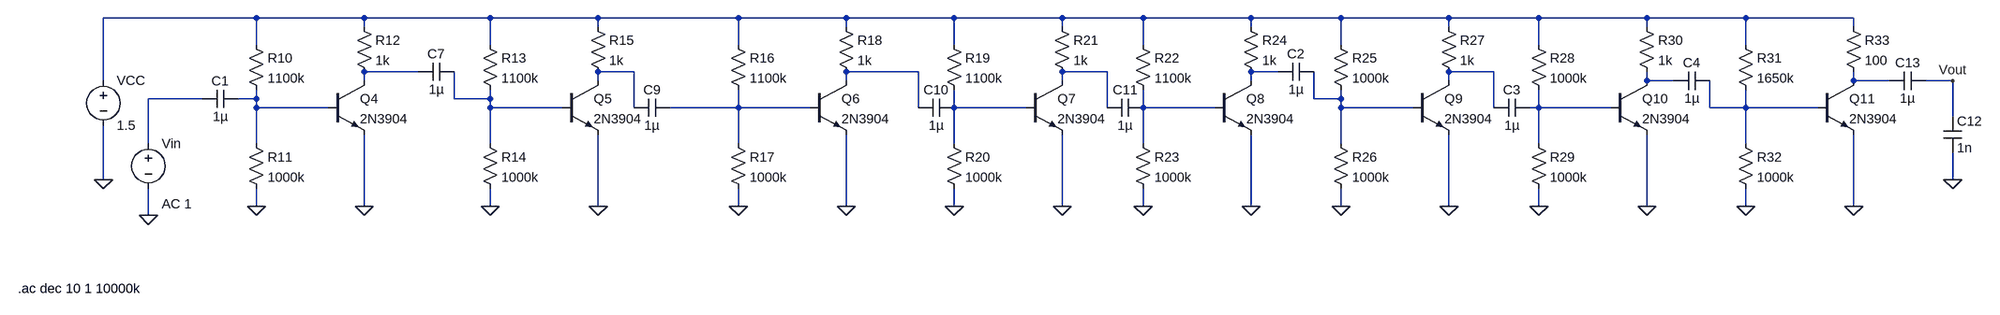
[diagram p0: schematic Bjt_Amp_LTspice.asc]
Bjt_Amp_LTspice.asc, the LTspice schematic file:
Version 4
SHEET 1 2344 728
WIRE -800 -400 -1072 -400
WIRE -608 -400 -800 -400
WIRE -384 -400 -608 -400
WIRE -192 -400 -384 -400
WIRE 64 -400 -192 -400
WIRE 256 -400 64 -400
WIRE 448 -400 256 -400
WIRE 640 -400 448 -400
WIRE 784 -400 640 -400
WIRE 976 -400 784 -400
WIRE 1136 -400 976 -400
WIRE 1328 -400 1136 -400
WIRE 1488 -400 1328 -400
WIRE 1680 -400 1488 -400
WIRE 1856 -400 1680 -400
WIRE 2048 -400 1856 -400
WIRE -608 -384 -608 -400
WIRE -192 -384 -192 -400
WIRE 256 -384 256 -400
WIRE 640 -384 640 -400
WIRE 976 -384 976 -400
WIRE 1328 -384 1328 -400
WIRE 1680 -384 1680 -400
WIRE 2048 -384 2048 -400
WIRE -800 -352 -800 -400
WIRE -384 -352 -384 -400
WIRE 64 -352 64 -400
WIRE 448 -352 448 -400
WIRE 784 -352 784 -400
WIRE 1136 -352 1136 -400
WIRE 1488 -352 1488 -400
WIRE 1856 -352 1856 -400
WIRE -512 -304 -608 -304
WIRE -128 -304 -192 -304
WIRE 384 -304 256 -304
WIRE 720 -304 640 -304
WIRE 1024 -304 976 -304
WIRE 1408 -304 1328 -304
WIRE -1072 -288 -1072 -400
WIRE -608 -288 -608 -304
WIRE -192 -288 -192 -304
WIRE 256 -288 256 -304
WIRE 640 -288 640 -304
WIRE 976 -288 976 -304
WIRE 1328 -288 1328 -304
WIRE 1680 -288 1680 -304
WIRE 1728 -288 1680 -288
WIRE 2048 -288 2048 -304
WIRE 2112 -288 2048 -288
WIRE 2224 -288 2176 -288
WIRE -896 -256 -992 -256
WIRE -800 -256 -800 -272
WIRE -800 -256 -832 -256
WIRE -448 -256 -448 -304
WIRE -384 -256 -384 -272
WIRE -384 -256 -448 -256
WIRE 1088 -256 1088 -304
WIRE 1136 -256 1136 -272
WIRE 1136 -256 1088 -256
WIRE -800 -240 -800 -256
WIRE -672 -240 -800 -240
WIRE -384 -240 -384 -256
WIRE -256 -240 -384 -240
WIRE -128 -240 -128 -304
WIRE 64 -240 64 -272
WIRE 64 -240 -64 -240
WIRE 192 -240 64 -240
WIRE 384 -240 384 -304
WIRE 448 -240 448 -272
WIRE 576 -240 448 -240
WIRE 720 -240 720 -304
WIRE 784 -240 784 -272
WIRE 912 -240 784 -240
WIRE 1136 -240 1136 -256
WIRE 1264 -240 1136 -240
WIRE 1408 -240 1408 -304
WIRE 1488 -240 1488 -272
WIRE 1488 -240 1472 -240
WIRE 1616 -240 1488 -240
WIRE 1792 -240 1792 -288
WIRE 1856 -240 1856 -272
WIRE 1856 -240 1792 -240
WIRE 1984 -240 1856 -240
WIRE 2224 -224 2224 -288
WIRE -992 -176 -992 -256
WIRE -800 -176 -800 -240
WIRE -384 -176 -384 -240
WIRE 64 -176 64 -240
WIRE 448 -176 448 -240
WIRE 784 -176 784 -240
WIRE 1136 -176 1136 -240
WIRE 1488 -176 1488 -240
WIRE 1856 -176 1856 -240
WIRE -1072 -112 -1072 -208
WIRE 2224 -112 2224 -160
WIRE -800 -64 -800 -96
WIRE -608 -64 -608 -192
WIRE -384 -64 -384 -96
WIRE -192 -64 -192 -192
WIRE 64 -64 64 -96
WIRE 256 -64 256 -192
WIRE 448 -64 448 -96
WIRE 640 -64 640 -192
WIRE 784 -64 784 -96
WIRE 976 -64 976 -192
WIRE 1136 -64 1136 -96
WIRE 1328 -64 1328 -192
WIRE 1488 -64 1488 -96
WIRE 1680 -64 1680 -192
WIRE 1856 -64 1856 -96
WIRE 2048 -64 2048 -192
WIRE -992 -48 -992 -96
FLAG -1072 -112 0
FLAG -992 -48 0
FLAG -800 -64 0
FLAG -608 -64 0
FLAG -384 -64 0
FLAG -192 -64 0
FLAG 64 -64 0
FLAG 256 -64 0
FLAG 448 -64 0
FLAG 640 -64 0
FLAG 784 -64 0
FLAG 976 -64 0
FLAG 1136 -64 0
FLAG 1328 -64 0
FLAG 1488 -64 0
FLAG 1680 -64 0
FLAG 1856 -64 0
FLAG 2048 -64 0
FLAG 2224 -112 0
FLAG 2224 -288 Vout
SYMBOL voltage -1072 -304 R0
SYMATTR InstName VCC
SYMATTR Value 1.5
SYMBOL voltage -992 -192 R0
WINDOW 123 24 124 Left 2
WINDOW 39 0 0 Left 0
SYMATTR Value2 AC 1
SYMATTR InstName Vin
SYMATTR Value ""
SYMBOL res -816 -368 R0
SYMATTR InstName R10
SYMATTR Value 1100k
SYMBOL res -816 -192 R0
SYMATTR InstName R11
SYMATTR Value 1000k
SYMBOL res -624 -400 R0
SYMATTR InstName R12
SYMATTR Value 1k
SYMBOL cap -832 -272 R90
WINDOW 0 0 32 VBottom 2
WINDOW 3 32 32 VTop 2
SYMATTR InstName C1
SYMATTR Value 1µ
SYMBOL npn -672 -288 R0
SYMATTR InstName Q4
SYMATTR Value 2N3904
SYMBOL cap -448 -320 R90
WINDOW 0 0 32 VBottom 2
WINDOW 3 32 32 VTop 2
SYMATTR InstName C7
SYMATTR Value 1µ
SYMBOL res -400 -368 R0
SYMATTR InstName R13
SYMATTR Value 1100k
SYMBOL res -400 -192 R0
SYMATTR InstName R14
SYMATTR Value 1000k
SYMBOL res -208 -400 R0
SYMATTR InstName R15
SYMATTR Value 1k
SYMBOL npn -256 -288 R0
SYMATTR InstName Q5
SYMATTR Value 2N3904
SYMBOL cap -64 -256 R90
WINDOW 0 0 32 VBottom 2
WINDOW 3 32 32 VTop 2
SYMATTR InstName C9
SYMATTR Value 1µ
SYMBOL res 48 -368 R0
SYMATTR InstName R16
SYMATTR Value 1100k
SYMBOL res 48 -192 R0
SYMATTR InstName R17
SYMATTR Value 1000k
SYMBOL res 240 -400 R0
SYMATTR InstName R18
SYMATTR Value 1k
SYMBOL npn 192 -288 R0
SYMATTR InstName Q6
SYMATTR Value 2N3904
SYMBOL cap 448 -256 R90
WINDOW 0 0 32 VBottom 2
WINDOW 3 32 32 VTop 2
SYMATTR InstName C10
SYMATTR Value 1µ
SYMBOL res 432 -368 R0
SYMATTR InstName R19
SYMATTR Value 1100k
SYMBOL res 432 -192 R0
SYMATTR InstName R20
SYMATTR Value 1000k
SYMBOL res 624 -400 R0
SYMATTR InstName R21
SYMATTR Value 1k
SYMBOL npn 576 -288 R0
SYMATTR InstName Q7
SYMATTR Value 2N3904
SYMBOL cap 784 -256 R90
WINDOW 0 0 32 VBottom 2
WINDOW 3 32 32 VTop 2
SYMATTR InstName C11
SYMATTR Value 1µ
SYMBOL res 768 -368 R0
SYMATTR InstName R22
SYMATTR Value 1100k
SYMBOL res 768 -192 R0
SYMATTR InstName R23
SYMATTR Value 1000k
SYMBOL res 960 -400 R0
SYMATTR InstName R24
SYMATTR Value 1k
SYMBOL npn 912 -288 R0
SYMATTR InstName Q8
SYMATTR Value 2N3904
SYMBOL res 1120 -368 R0
SYMATTR InstName R25
SYMATTR Value 1000k
SYMBOL res 1120 -192 R0
SYMATTR InstName R26
SYMATTR Value 1000k
SYMBOL res 1312 -400 R0
SYMATTR InstName R27
SYMATTR Value 1k
SYMBOL npn 1264 -288 R0
SYMATTR InstName Q9
SYMATTR Value 2N3904
SYMBOL res 1472 -368 R0
SYMATTR InstName R28
SYMATTR Value 1000k
SYMBOL res 1472 -192 R0
SYMATTR InstName R29
SYMATTR Value 1000k
SYMBOL res 1664 -400 R0
SYMATTR InstName R30
SYMATTR Value 1k
SYMBOL npn 1616 -288 R0
SYMATTR InstName Q10
SYMATTR Value 2N3904
SYMBOL res 1840 -368 R0
SYMATTR InstName R31
SYMATTR Value 1650k
SYMBOL res 1840 -192 R0
SYMATTR InstName R32
SYMATTR Value 1000k
SYMBOL res 2032 -400 R0
SYMATTR InstName R33
SYMATTR Value 100
SYMBOL npn 1984 -288 R0
SYMATTR InstName Q11
SYMATTR Value 2N3904
SYMBOL cap 2208 -224 R0
SYMATTR InstName C12
SYMATTR Value 1n
SYMBOL cap 2176 -304 R90
WINDOW 0 0 32 VBottom 2
WINDOW 3 32 32 VTop 2
SYMATTR InstName C13
SYMATTR Value 1µ
SYMBOL cap 1088 -320 R90
WINDOW 0 0 32 VBottom 2
WINDOW 3 32 32 VTop 2
SYMATTR InstName C2
SYMATTR Value 1µ
SYMBOL cap 1472 -256 R90
WINDOW 0 0 32 VBottom 2
WINDOW 3 32 32 VTop 2
SYMATTR InstName C3
SYMATTR Value 1µ
SYMBOL cap 1792 -304 R90
WINDOW 0 0 32 VBottom 2
WINDOW 3 32 32 VTop 2
SYMATTR InstName C4
SYMATTR Value 1µ
TEXT -1224 136 Left 2 !.ac dec 10 1 10000k

The netlist it stands for:
* Bjt_Amp_LTspice.asc
VCC N001 0 1.5
Vin N010 0 AC 1
R10 N001 N011 1100k
R11 N011 0 1000k
R12 N001 N002 1k
C1 N011 N010 1µ
Q4 N002 N011 0 0 2N3904
C7 N012 N002 1µ
R13 N001 N012 1100k
R14 N012 0 1000k
R15 N001 N003 1k
Q5 N003 N012 0 0 2N3904
C9 N014 N003 1µ
R16 N001 N014 1100k
R17 N014 0 1000k
R18 N001 N004 1k
Q6 N004 N014 0 0 2N3904
C10 N015 N004 1µ
R19 N001 N015 1100k
R20 N015 0 1000k
R21 N001 N005 1k
Q7 N005 N015 0 0 2N3904
C11 N016 N005 1µ
R22 N001 N016 1100k
R23 N016 0 1000k
R24 N001 N006 1k
Q8 N006 N016 0 0 2N3904
R25 N001 N013 1000k
R26 N013 0 1000k
R27 N001 N007 1k
Q9 N007 N013 0 0 2N3904
R28 N001 N017 1000k
R29 N017 0 1000k
R30 N001 N008 1k
Q10 N008 N017 0 0 2N3904
R31 N001 N018 1650k
R32 N018 0 1000k
R33 N001 N009 100
Q11 N009 N018 0 0 2N3904
C12 Vout 0 1n
C13 Vout N009 1µ
C2 N013 N006 1µ
C3 N017 N007 1µ
C4 N018 N008 1µ
.model NPN NPN
.model PNP PNP
.lib standard.bjt
.ac dec 10 1 10000k
.backanno
.end